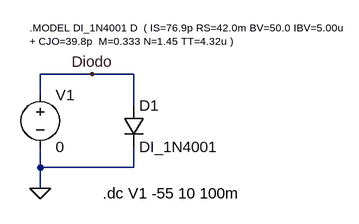
[diagram p0: schematic Diodo 1N4001 (regions).asc]
Diodo 1N4001 (regions).asc, the LTspice schematic file:
Version 4
SHEET 1 880 680
WIRE 176 80 96 80
WIRE 240 80 176 80
WIRE 96 112 96 80
WIRE 240 128 240 80
WIRE 96 224 96 192
WIRE 240 224 240 192
WIRE 240 224 96 224
WIRE 96 256 96 224
FLAG 176 80 Diodo
FLAG 96 256 0
SYMBOL diode 224 128 R0
SYMATTR InstName D1
SYMATTR Value DI_1N4001
SYMBOL voltage 96 96 R0
SYMATTR InstName V1
SYMATTR Value 0
TEXT 192 264 Left 2 !.dc V1 -55 10 100m
TEXT 80 8 Left 1 !.MODEL DI_1N4001 D  ( IS=76.9p RS=42.0m BV=50.0 IBV=5.00u\n+ CJO=39.8p  M=0.333 N=1.45 TT=4.32u )

The netlist it stands for:
* Diodo 1N4001 (regions).asc
D1 Diodo 0 DI_1N4001
V1 Diodo 0 0
.model D D
.lib standard.dio
.dc V1 -55 10 100m
.MODEL DI_1N4001 D  ( IS=76.9p RS=42.0m BV=50.0 IBV=5.00u
+ CJO=39.8p  M=0.333 N=1.45 TT=4.32u )
.backanno
.end